# Altium schematic sheet Watchdog.SchDoc: 24-bit Analog to Digital converter
size A4; Author: Grzegorz Gajoch; DocumentNumber: 6; SheetNumber: 6; SheetTotal: 16; Model: EM1; PageSetup: Record=PageOptions|CenterHorizontal=True|CenterVertical=True|PrintScale=0.52|XCorrection=1.00|YCorrection=1.00|PrintKind=1|BorderSize=5000000|LeftOffset=0|BottomOffset=0|Orientation=2|PaperLength=4200|PaperWidth=2970|Scale=100|PaperSource=7|PrintQuality=600|MediaType=1|DitherType=10|PaperKind=A3|PrintScaleMode=1
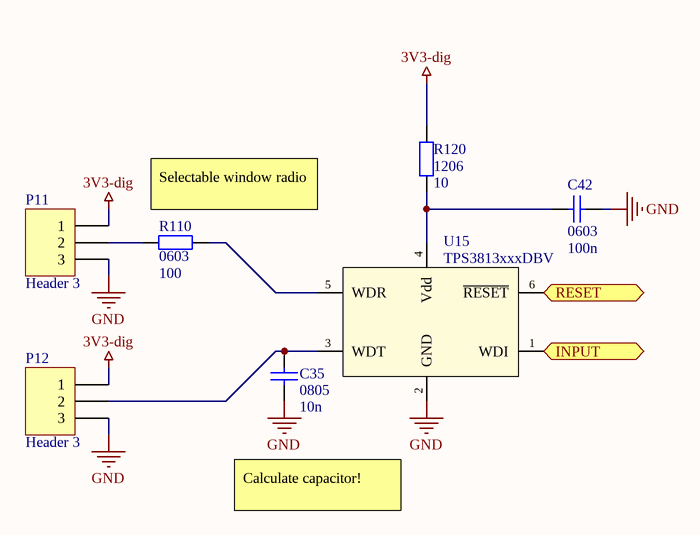
[diagram p0: Watchdog.SchDoc]

## Parts
C35  0805  value 10n  [SMD_Capacitor_0805]
C42  0603  value 100n  [SMD_Capacitor_0603]
P11  Header 3  [HDR1X3]
P12  Header 3  [HDR1X3]
R110  0603  value 100  [SMD_Resistor_0603]
R120  1206  value 10  [SMD_Resistor_1206]
U15  TPS3813xxxDBV  [SOT23-6]

## Ports
INPUT (in), RESET (out)

## Nets
3V3-dig: P11.1 P12.1 R120.1
GND: C35.1 C42.1 P11.3 P12.3 U15.2(GND)
INPUT: U15.1(WDI) ; port INPUT
RESET: U15.6(~{RESET}) ; port RESET
NetC35_2: C35.2 P12.2 U15.3(WDT)
NetC42_2: C42.2 R120.2 U15.4(Vdd)
NetP11_2: P11.2 R110.1
NetR110_2: R110.2 U15.5(WDR)

## Notes on the sheet
- (near R110) Selectable window radio
- Calculate capacitor!
- Title:
- Sheet:
- of
- Author:
- Model:
- Document Number:
- Checked by:
- Iss-Rev:
- Approved by:
- Date:
- File name:

## Library data of the parts
C35 = Cap: Capacitor; Published: 8-Jun-2000; LatestRevisionDate: 17-Jul-2002; LatestRevisionNote: Re-released for DXP Platform.; PackageReference: RAD-0.3; Publisher: Altium Limited; PackageDescription: Radial Cap, Thru-Hole; 2 Leads; 0.3 in Pin Spacing
C42 = Cap1: Capacitor; Published: 8-Jun-2000; LatestRevisionDate: 17-Jul-2002; LatestRevisionNote: Re-released for DXP Platform.; PackageReference: RAD-0.3; Publisher: Altium Limited; PackageDescription: Radial Cap, Thru-Hole; 2 Leads; 0.3 in Pin Spacing
P11 P12 = Header 3: Header, 3-Pin; LatestRevisionDate: 17-Jul-2002; LatestRevisionNote: Re-released for DXP Platform.; Publisher: Altium Limited
R110 R120 = Res2: Resistor; Published: 8-Jun-2000; LatestRevisionDate: 17-Jul-2002; LatestRevisionNote: Re-released for DXP Platform.; PackageReference: AXIAL-0.4; Publisher: Altium Limited; PackageDescription: Axial Device, Thru-Hole; 2 Leads; 0.4 in Pin Spacing
U15 = TPS3813xxxDBV: Processor Supervisory Circuits with Window-Watchdog.; Manufacturer: Texas Instruments; Value: TPS3813xxxDBV